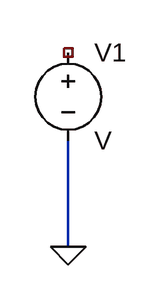
[diagram p0: schematic Draft1.asc]
Draft1.asc, the LTspice schematic file:
Version 4.1
SHEET 1 880 680
WIRE 96 256 96 160
FLAG 96 256 0
SYMBOL voltage 96 64 R0
SYMATTR InstName V1

The netlist it stands for:
* Draft1.asc
V1 NC_01 0 V
.backanno
.end